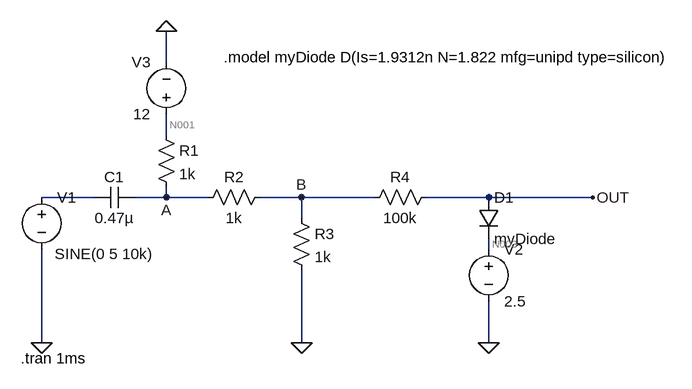
[diagram p0: schematic circuito_3_lab_1.asc]
circuito_3_lab_1.asc, the LTspice schematic file:
Version 4
SHEET 1 1192 680
WIRE 144 -80 144 -128
WIRE 144 32 144 0
WIRE 32 128 -48 128
WIRE 144 128 144 112
WIRE 144 128 96 128
WIRE 208 128 144 128
WIRE 352 128 288 128
WIRE 464 128 352 128
WIRE 640 128 544 128
WIRE 800 128 640 128
WIRE 352 160 352 128
WIRE 640 208 640 192
WIRE -48 352 -48 208
WIRE 352 352 352 240
WIRE 640 352 640 288
FLAG 640 352 0
FLAG 352 352 0
FLAG -48 352 0
FLAG 144 -128 0
FLAG 800 128 OUT
FLAG 144 128 A
FLAG 352 128 B
SYMBOL voltage -48 112 R0
WINDOW 3 20 103 Left 2
WINDOW 123 0 0 Left 0
WINDOW 39 0 0 Left 0
SYMATTR Value SINE(0 5 10k)
SYMATTR InstName V1
SYMBOL res 128 16 R0
SYMATTR InstName R1
SYMATTR Value 1k
SYMBOL res 336 144 R0
SYMATTR InstName R3
SYMATTR Value 1k
SYMBOL res 304 112 R90
WINDOW 0 0 56 VBottom 2
WINDOW 3 32 56 VTop 2
SYMATTR InstName R2
SYMATTR Value 1k
SYMBOL res 560 112 R90
WINDOW 0 0 56 VBottom 2
WINDOW 3 32 56 VTop 2
SYMATTR InstName R4
SYMATTR Value 100k
SYMBOL diode 624 128 R0
SYMATTR InstName D1
SYMATTR Value myDiode
SYMBOL voltage 640 192 R0
WINDOW 123 0 0 Left 0
WINDOW 39 0 0 Left 0
SYMATTR InstName V2
SYMATTR Value 2.5
SYMBOL cap 96 112 R90
WINDOW 0 0 32 VBottom 2
WINDOW 3 32 32 VTop 2
SYMATTR InstName C1
SYMATTR Value 0.47µ
SYMBOL voltage 144 16 R180
WINDOW 0 24 96 Left 2
WINDOW 3 24 16 Left 2
WINDOW 123 0 0 Left 0
WINDOW 39 0 0 Left 0
SYMATTR InstName V3
SYMATTR Value 12
TEXT -80 376 Left 2 !.tran 1ms
TEXT 232 -88 Left 2 !.model myDiode D(Is=1.9312n N=1.822 mfg=unipd type=silicon)

The netlist it stands for:
* circuito_3_lab_1.asc
V1 N002 0 SINE(0 5 10k)
R1 N001 A 1k
R3 B 0 1k
R2 B A 1k
R4 OUT B 100k
D1 OUT N003 myDiode
V2 N003 0 2.5
C1 A N002 0.47µ
V3 N001 0 12
.model D D
.lib standard.dio
.tran 1ms
.model myDiode D(Is=1.9312n N=1.822 mfg=unipd type=silicon)
.backanno
.end

* Results of the author's LTspice run, read from the files saved beside the schematic
* Operating Point, zero values left out:
*   V(n001) = 12 V
*   V(a) = 7.996 V
*   V(b) = 3.993 V
*   V(out) = 2.907 V
*   V(n003) = 2.5 V
*   I(D1) = 10.86 µA
*   I(R4) = -10.86 µA
*   I(R2) = -4.004 mA
*   I(R3) = 3.993 mA
*   I(R1) = 4.004 mA
*   I(V3) = -4.004 mA
*   I(V2) = 10.86 µA
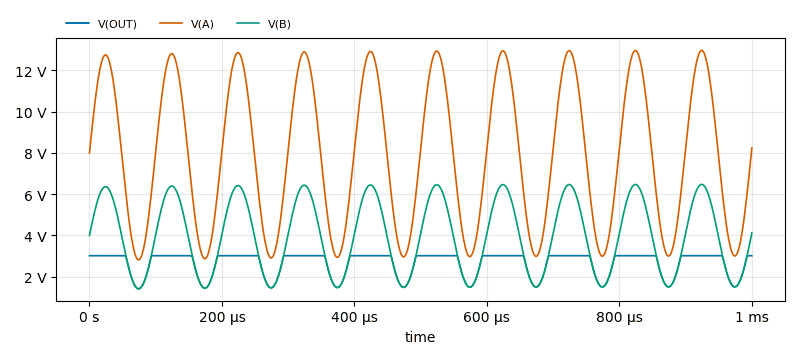
[diagram p1: Transient Analysis of circuito_3_lab_1.asc, plotted from the saved traces]
* Transient Analysis, 1 run:
*   V(OUT): min 1.404 V, max 3.009 V, average 2.633 V, rms 2.693 V, last 3.009 V
*   V(A): min 2.809 V, max 12.97 V, average 7.92 V, rms 8.669 V, last 8.239 V
*   V(B): min 1.404 V, max 6.468 V, average 3.954 V, rms 4.326 V, last 4.114 V